# EAGLE design SuperScreen (EAGLE 9.1.2)
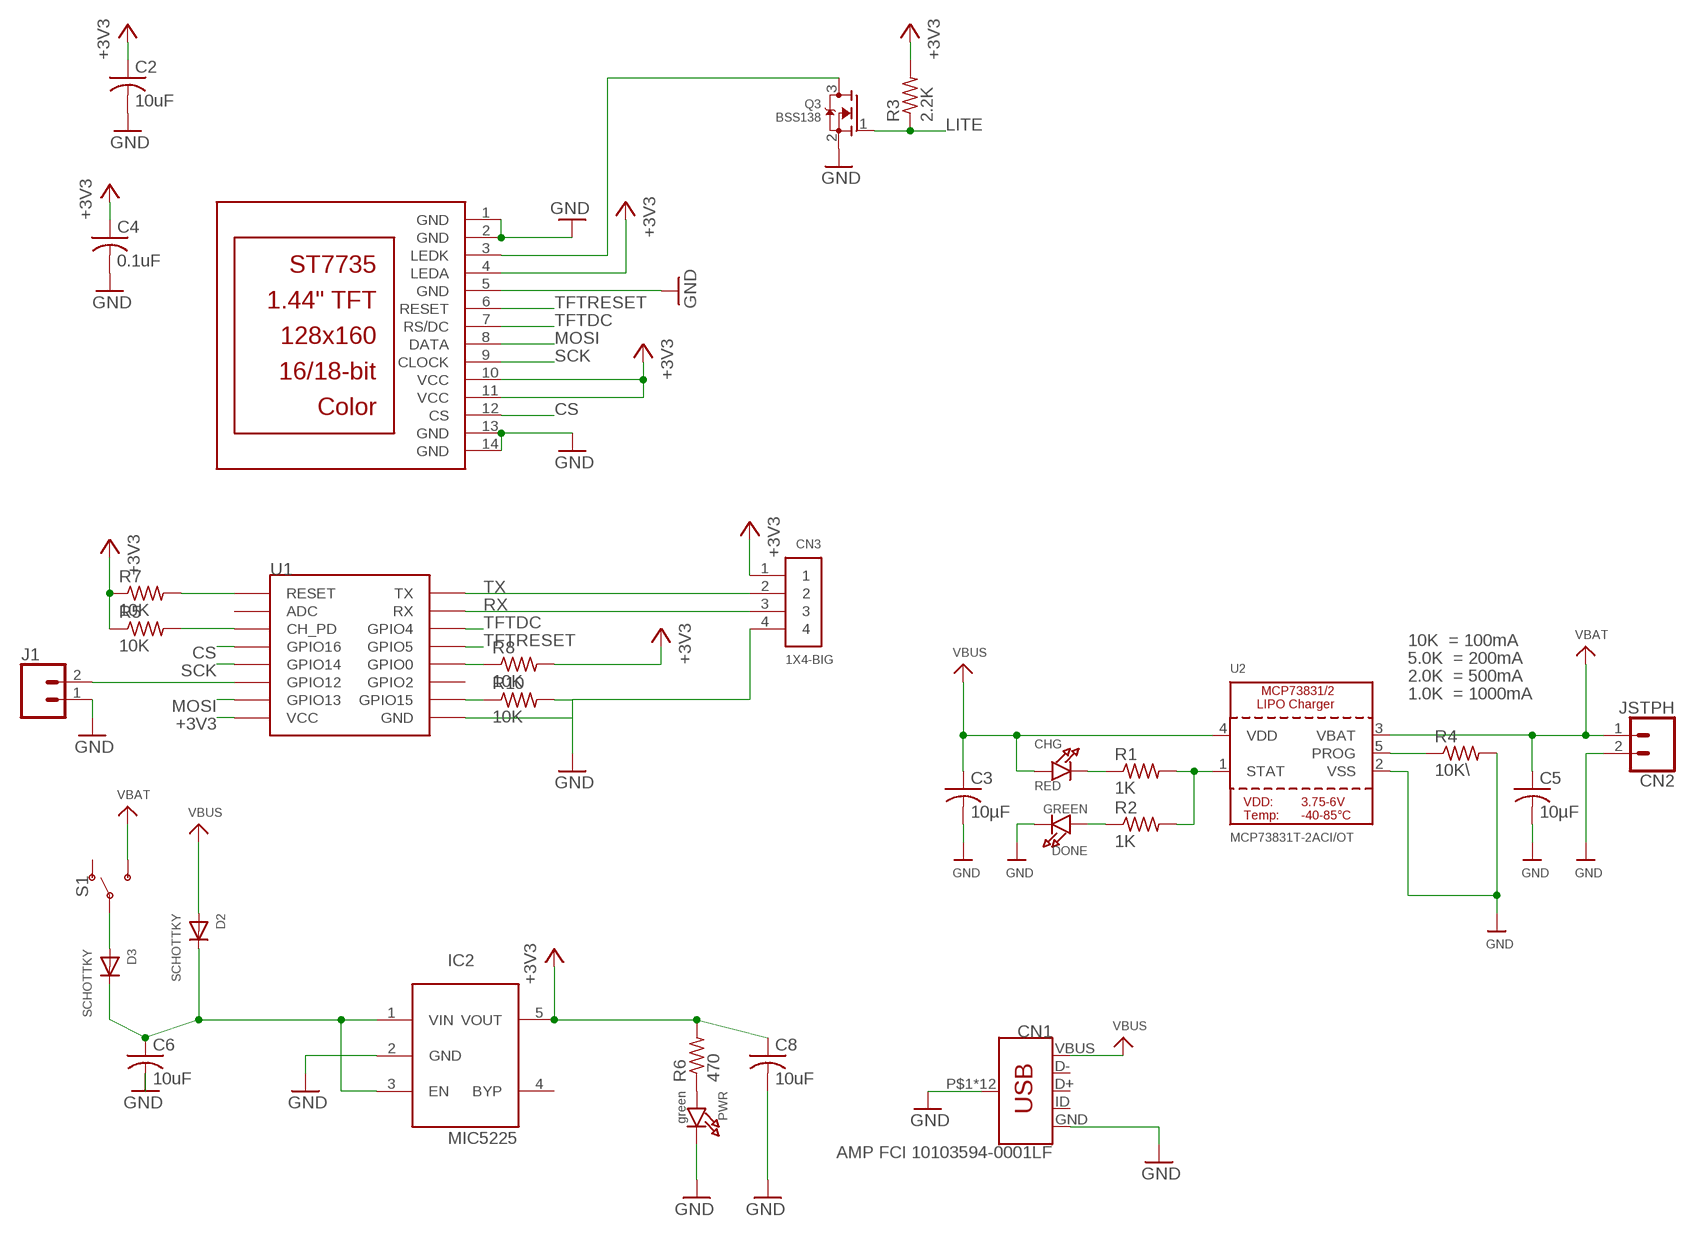
[diagram p0: schematic, sheet 1]

## Parts
C2  10uF  C-USC0805  [C0805]
C3  10µF  C-USC0805  [C0805]
C4  0.1uF  C-USC0805  [C0805]
C5  10µF  C-USC0805  [C0805]
C6  10uF  C-USC0805  [C0805]
C8  10uF  C-USC0805  [C0805]
CHG  RED  LED0805_NOOUTLINE  [CHIPLED_0805_NOOUTLINE]
CN1  AMP FCI 10103594-0001LF  USB_MICRO-B_HALF_PTH  [USB-MICROB-PTH]
CN2  JSTPH  CONN_02  [1X02]
CN3  1X4-BIG  [1X04-BIG]
D2  SCHOTTKY  DIODE_SOD-123FL  [SOD-123FL]
D3  SCHOTTKY  DIODE_SOD-123FL  [SOD-123FL]
DONE  GREEN  LED0805_NOOUTLINE  [CHIPLED_0805_NOOUTLINE]
IC2  MIC5225  LP298XS  [SOT23-5L]
J1  CONN_02  [1X02]
PWR  green  LED0805_NOOUTLINE  [CHIPLED_0805_NOOUTLINE]
Q3  BSS138  MOSFET-NWIDE  [SOT23-WIDE]
R1  1K  R-US_R0805  [R0805]
R2  1K  R-US_R0805  [R0805]
R3  2.2K  R-US_R0805  [R0805]
R4  10K\  R-US_R0805  [R0805]
R5  10K  R-US_R0805  [R0805]
R6  470  R-US_R0805  [R0805]
R7  10K  R-US_R0805  [R0805]
R8  10K  R-US_R0805  [R0805]
R10  10K  R-US_R0805  [R0805]
S1  SWITCH-SPDT-SMD-RIGHT-ANGLE  [SWITCH_SPST_SMD_A]
TFT2  DISP_LCD_ST7735_1.44IN  [TFT_1.44IN_128_128]
U1  ESP12SMD  [ESP12-SMD]
U2  MCP73831T-2ACI/OT  MCP73831/2  [SOT23-5]

## Nets
+3V3 [power]: C2.1 C4.1 C8.1 CN3.1 IC2.5(VOUT) R3.2 R5.1 R6.2 R7.1 R8.2 TFT2.4(LEDA) TFT2.10(VCC) TFT2.11(VCC) U1.VCC
CS: TFT2.12(CS) U1.GPIO16
GND [power]: C2.2 C3.2 C4.2 C5.2 C6.2 C8.2 CN1.GND CN1.P$1(SHIELD) CN1.P$2(SHIELD) CN1.P$3(SHIELD) CN1.P$4(SHIELD) CN1.P$6(SHIELD) CN1.P$8(SHIELD) CN1.P$10(SHIELD) CN1.P$12(SHIELD) CN1.SHEILD2(SHIELD) CN1.SHIELD CN1.SHIELD3(SHIELD) CN1.SHIELD4(SHIELD) CN2.2 CN3.4 DONE.C IC2.2(GND) J1.1 PWR.C Q3.2(S) R4.2 R10.2 TFT2.1(GND) TFT2.2(GND) TFT2.5(GND) TFT2.13(GND) TFT2.14(GND) U1.GND U2.2(VSS)
LED- [power]: Q3.3(D) TFT2.3(LEDK)
LITE: Q3.1(G) R3.1
MOSI: TFT2.8(DATA) U1.GPIO13
N$1: CHG.C R1.1
N$2: R7.2 U1.RESET
N$3 [power]: D3.A S1.2(P)
N$4: R1.2 R2.2 U2.1(STAT)
N$6: J1.2 U1.GPIO12
N$8: R4.1 U2.5(PROG)
N$9: PWR.A R6.1
N$10: DONE.A R2.1
N$11: R8.1 U1.GPIO0
N$13 [power]: C6.1 D2.C D3.C IC2.1(VIN) IC2.3(EN)
N$15: R5.2 U1.CH_PD
N$16: R10.1 U1.GPIO15
RX: CN3.3 U1.RXD0(RX)
SCK: TFT2.9(CLOCK) U1.GPIO14
TFTDC: TFT2.7(RS/DC) U1.GPIO4
TFTRESET: TFT2.6(RESET) U1.GPIO5
TX: CN3.2 U1.TXD0(TX)
VBAT [power]: C5.1 CN2.1 S1.3(S) U2.3(VBAT)
VBUS [power]: C3.1 CHG.A CN1.VBUS D2.A U2.4(VDD)
Unconnected: CN1.D+ CN1.D- CN1.ID IC2.4(BYP) S1.1(O) U1.ADC U1.GPIO2

## Notes on the sheet
- 10K  = 100mA
- 5.0K  = 200mA
- 2.0K  = 500mA
- 1.0K  = 1000mA

## Library data of the parts
C2-C6 C8 = adafruit:C-US: CAPACITOR, American symbol
CHG DONE PWR = microbuilder:LED: LED 0603 - 0603 Surface Mount Package 2mA: Green LED - Low Power (3.9mcd, 2ma, 1.7Vf) - Digikey: 475-2709-2-ND Orange LED - Low Power (9.8mcd, 2ma, 1.8Vf) - Digikey: 475-1194-2-ND Red LED - Low Power (5mcd, 2ma, 1.8Vf) - Digikey: 475-1195-2-ND Yellow LED - Low Power (7mcd, 2ma, 1.8Vf) - Digikey: 475-1196-2-ND 5mA: Blue LED - Low Power (17mcd, 5ma, 2.9Vf) - Digikey: LNJ937W8CRACT-ND 0805 - 0805 Surface Mount Package 2mA: Red LED (8.8mcd, 2mA, 1.8Vf, Clear) - Low Power [Digikey: 475-2510-1-ND] Green LED (5mcd, 2mA, 1.8Vf, Clear) - Low Power [Digikey: 475-2730-1-ND] Yellow LED (11.3mcd, 2mA, 1.8Vf, Clear) - Low Power [Digikey: 475-2555-1-ND] 20mA: Red LED (104mcd, 20mA, Diffused) - LS R976 [Digikey: 475-1278-6-ND] Red LED (12mcd, 20mA, 2.0Vf, Clear) - APT2012EC [Digikey: 754-1128-1-ND] Green LED (15mcd, 20mA, 2.2Vf, Clear) - APT2012GC [Digikey: 754-1131-1-ND] Orange LED (160mcd, 20mA, 2.1Vf, Clear) - APT2012SECK [Digikey: 754-1130-1-ND] 1206 - 1206 Surface Mount Package Green LED (26mcd, 20mA, Diffused) - LG N971 [Digikey: 475-1407-6-ND] Red LED (15mcd, 20mA, Diffused) - LH N974 [Digikey: 475-1416-6-ND] Cree - Cree High-Power Surface Mount LEDs XPEBWT-L1-0000-00D50 - White 111lm 350mA 2.9Vf 6200K 110° XTEAWT-00-0000-00000LEE3 - White 114lm 350mA 2.85Vf 5000K 115° Everlight - Everlight 45-21 Series Surface Mount LEDs 45-21/QK2C-B2832AC2CB2/2T - Warm White 2000mcd 20mA 3.25Vf 3050K 120° 45-21/LK2C-B38452C4CB2/2T - Nuetral White 2000mcd 20mA 3.25Vf 4150K 120° 45-21/LK2C-B50634C6CB2/2T - Cold White 2200mcd 20mA 3.25Vf 5650K 120° PLCC2 Reverse Mount LS T77K-J1L2-1-0-2-R18-Z - Red 11.25mcd 2mA 1.8Vf 630nm 120° LO T77K-L1M2-24-Z - Orange 19.6mcd 2mA 1.8Vf 606nm 120° LY T77K-K2M1-26-Z - Yellow 15.7mcd 2mA 1.8Vf 587nm 120°
CN1 = SparkFun-Connectors:USB_MICRO-B: USB Type Micro-B Connector Male/female and PTH/SMT variants SparkFun Products: SparkFun microB USB Breakout <https://www.sparkfun.com/products/12035> SparkFun USB microB Plug Breakout <https://www.sparkfun.com/products/10031> SparkFun ESP8266 Thing <https://www.sparkfun.com/products/13231>; PROD_ID: CONN-13711
CN2 J1 = SparkFun-Connectors:CONN_02: Multi connection point. Often used as Generic Header-pin footprint for 0.1 inch spaced/style header connections On any of the 0.1 inch spaced packages, you can populate with these: Break Away Headers - Straight <https://www.sparkfun.com/products/116> (PRT-00116) Break Away Male Headers - Right Angle <https://www.sparkfun.com/products/553> (PRT-00553) Female Headers <https://www.sparkfun.com/products/115> (PRT-00115) Break Away Headers - Machine Pin <https://www.sparkfun.com/products/117> (PRT-00117) Break Away Female Headers - Swiss Machine Pin <https://www.sparkfun.com/products/743> (PRT-00743) For SCREWTERMINALS and SPRING TERMINALS visit here: Screw Terimnals on SparkFun.com <https://www.sparkfun.com/search/results?term=Screw+Terminals> (5mm/3.5mm/2.54mm spacing) This device is also useful as a general connection point to wire up your design to another part of your project. Our various solder wires solder well into these plated through hole pads. Hook-Up Wire - Assortment (Stranded, 22 AWG) <https://www.sparkfun.com/products/11375> (PRT-11375) Hook-Up Wire - Assortment (Solid Core, 22 AWG) <https://www.sparkfun.com/products/11367> (PRT-11367) View the entire wire category on our website here <https://www.sparkfun.com/categories/141> Special notes: Molex polarized connector foot print use with: PRT-08233 with associated crimp pins and housings. 2.54_SCREWTERM for use with PRT-10571. 3.5mm Screw Terminal footprints for PRT-08084 5mm Screw Terminal footprints for use with PRT-08432
CN3 = adafruit:1X4: 4-pin connector
D2 D3 = adafruit:DIODE: Diode SMADIODE - SMA Surface Mount Package 20V 1A Schottky Diode Digikey: 641-1014-6-ND DO-1N4148 - Through Hole Small Current Diode SOD-123 20V 1 A (.5mV Vf) Schottky Diode - Digikey: MBRX120TPMSCT-ND SOD-323 10V 570mA (.38mV Vf, 3ns) Schottky Diode - Digikey: ZLLS410CT-ND SOD-523 30V 30mA Schottky Diode (RB751S-40TE61) - Digikey: RB751S-40TE61CT-ND SOT23-R/W - SOT23 Package (R = Solder Paste/Reflow Ovens, W = Hand-Soldering) BAT54Film 40V 300mA - Digikey: 497-7162-1-ND
IC2 = adafruit:LP298X
Q3 = microbuilder:MOSFET-N: N-Channel Mosfet LEGEND VDS: Voltage Drain-Source ID: Drain Current RDS(ON): Drain-Source On-State Resistance VGS(TH): Gate-Source Threshold Voltage CISS: Drain-Source Input Capacitance SOT-23 Name VDS ID RDS(ON) VGS(TH) CISS Order Number 2N7002E 60V 260mA 2.5 Ohm 2.5V @ 250uA 26.7pF @ 25V 2N7002ET1GOSTR-ND BSH103 30V 850mA 400 mOhm 400mV @ 1mA 83pF @ 24V BSH103,235-ND BSS138 60V 320mA 1.6 Ohm 1.5V @ 250uA 50pF @ 10V Mouser: 771-BSS138PW115 DMN2075U-7 20V 4.2A 38 mOhm 1V @ 250 uA 594.3pF @ 10V DMN2075U-7DICT-ND * BSS138 good choice for I2C level-shifting POWERPAK 1212-8 Name VDS ID RDS(ON) VGS(TH) CISS Order Number Si7308DN 60V 6A 58 mOhm 3V @ 250uA 665pF @ 15V SI7308DN-T1-E3CT-ND
R1-R8 R10 = adafruit:R-US_: RESISTOR, American symbol
S1 = SparkFun-Switches:SWITCH-SPDT: Single Pole, Double Throw (SPDT) Switch Single-pole, double-throw (SPDT) switch. Variant Overview SMD-AYZ0202 Surface Mount DPDT Switch <https://www.sparkfun.com/products/597> (COM-00597) Used on e.g. LilyPad Arduino USB - ATmega32U4 Board <https://www.sparkfun.com/products/12049> PTH-11.6X4.0MM SPDT Mini Power Switch <https://www.sparkfun.com/products/102> (COM-00102) Used on e.g. SparkFun Simon Says - Through-Hole Soldering Kit <https://www.sparkfun.com/products/10547> (KIT-10547) PTH-11.6X4.0MM-KIT KIT version of SPDT Mini Power Switch - Simplifies soldering by removing tStop of switch pins - only one side can be soldered. PTH-11.6X4.0MM-LOCK LOCK version of SPDT Mini Power Switch - Offset pins hold switch in place for easier soldering. SMD-RIGHT-ANGLE Surface Mount Right Angle Switch <https://www.sparkfun.com/products/10860> (COM-10860) Used on e.g. SparkFun ESP8266 Thing <https://www.sparkfun.com/products/13231>; PROD_ID: SWCH-10651; SF_SKU: COM-10860
TFT2 = microbuilder:DISP_LCD_ST7735_1.44IN
U1 = esp8266modules:ESP12: ESP8266 Wifi module 12
U2 = microbuilder:MCP73831/2: MCP73831/2 LIPO Charger VDD: 3.75 - 6V Temp -40 - 85°C Programmable Charge Rate: 15-500mA NOTE: STAT is a tri-state logic output on the MCP73831 and an open-drain output on the MCP73832. SOT23-5 with 4.2V output and tri-state logic on STAT = MCP73831T-2ACI/OT

## Net classes
1 power: width 0.406 mm

## Board
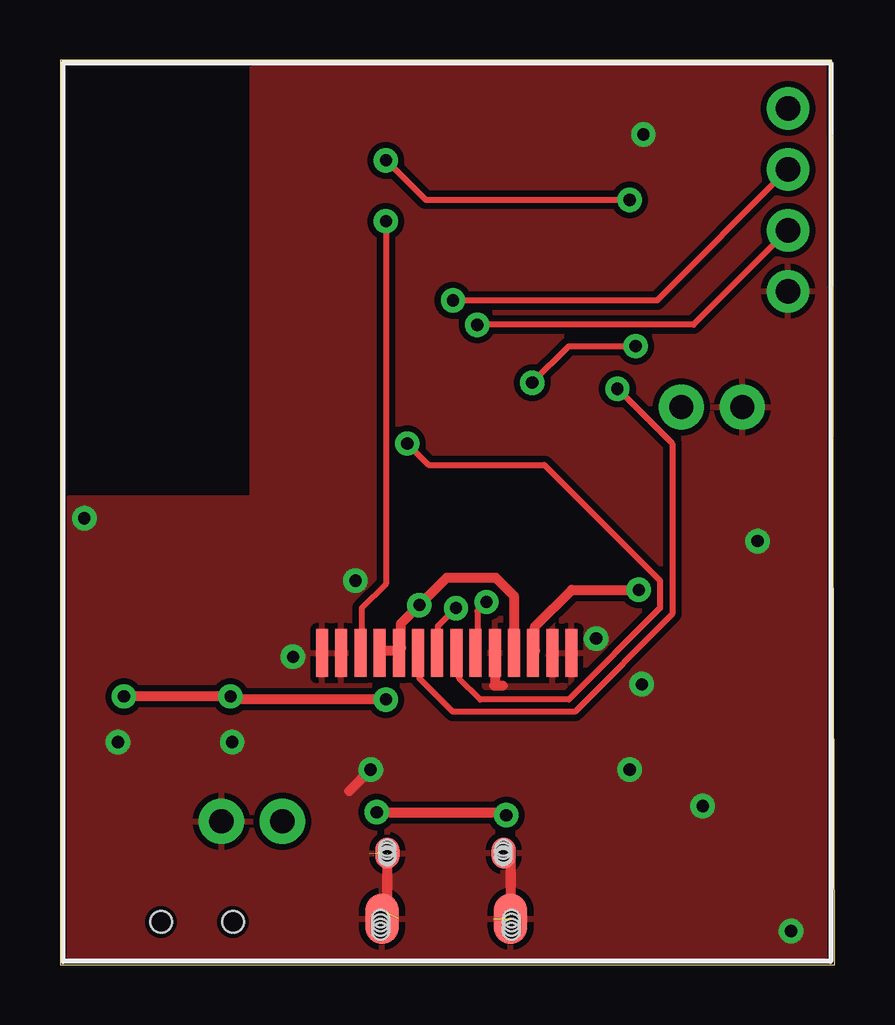
[diagram p1: board, top side]
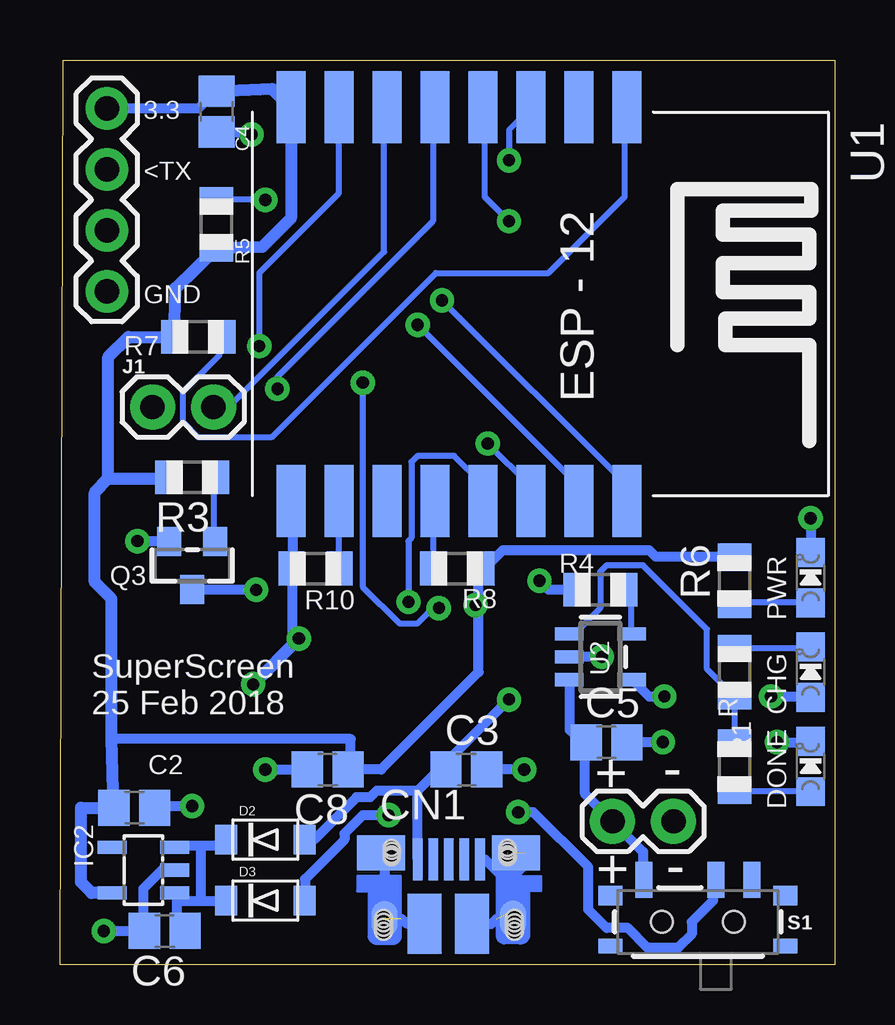
[diagram p2: board, bottom side, seen from below]

Size 32.31 x 37.71 mm. Coordinates in mm from the lower left corner, seen from the top.
Outline: 0,0 32.31,0 32.18,37.71 0,37.71 0,0
Copper layers (1*16): Top 0.035mm / dielectric 1.5mm / Bottom 0.035mm
Design rules "SparkFun-2-layer-STANDARD": minimum track width 10mil, minimum drill 20mil, track to track 10mil, track to pad 8mil, pad to pad 8mil, via to via 10mil, smd to smd 8mil, copper to edge 8mil, drill to drill 8mil, minimum pad ring 10mil, minimum via ring 10mil, stop-mask expansion 4mil, vias tented up to drill 25mil, thermal gap 10mil

### Footprints (pad centres in the part's own frame; a part is rotated, then mirrored left to right if it is on the bottom)
C0805 = smd 1.3 x 1.5: 1 -0.85,0; 2 0.85,0
CHIPLED_0805_NOOUTLINE = smd 1.2 x 1.2: A 0,-1.05; C 0,1.05
USB-MICROB-PTH = smd 0.4 x 1.75: D+ 0.031,1.331; D- -0.619,1.331; GND 1.331,1.331; ID 0.681,1.331; VBUS -1.269,1.331 | smd 1.4 x 2.1 bottom: P$1 2.701,-1.142; P$3 -2.659,-1.144 | smd 1 x 1.3: P$2 2.487,1.594; P$6 -2.368,1.604 | smd 1 x 1.3 bottom: P$4 -2.368,1.604; P$10 2.481,1.598 | smd 1.1 x 1.5: P$8 2.701,-1.142; P$12 -2.659,-1.144 | smd 2 x 1.46: SHEILD2 2.831,1.606; SHIELD -2.794,1.606 | smd 1.425 x 2.5: SHIELD3 -0.979,-1.349; SHIELD4 0.996,-1.352 | hole 0.7: -2.693,-1.134; -2.693,-1.3; -2.694,-1.499; -2.694,-1.664; 2.768,-1.134; 2.767,-1.303; 2.766,-1.496; 2.766,-1.664 | hole 0.66: -2.359,1.821; -2.349,1.691; -2.359,1.541; -2.354,1.432; 2.481,1.821; 2.491,1.691; 2.481,1.541; 2.486,1.432
1X02 = drill 1.016 pad 1.88: 1 0,0; 2 2.54,0
1X04-BIG = drill 1.016 pad 1.778: 1 0,0; 2 2.54,0; 3 5.08,0; 4 7.62,0
SOD-123FL = smd 0.91 x 1.22: A 1.637,0; C -1.637,0
SOT23-5L = smd 0.55 x 1.2: 1 -0.95,-1.3; 2 0,-1.3; 3 0.95,-1.3; 4 0.95,1.3; 5 -0.95,1.3
SOT23-WIDE = smd 1 x 1.2: 1 -0.95,-1; 2 0.95,-1; 3 0,1
R0805 = smd 1.1 x 1.4: 1 -1,0; 2 1,0
SWITCH_SPST_SMD_A = smd 0.7 x 1.5: 1 -2.25,-1.75; 2 -0.75,-1.75; 3 2.25,-1.75 | smd 1 x 0.6: GND1 -3.65,1; GND3 3.65,1 | smd 1 x 0.8: GND2 -3.65,-1.1; GND4 3.65,-1.1 | hole 0.9: -1.5,0; 1.5,0
TFT_1.44IN_128_128 = smd 0.5 x 2: 1 5.2,12.855; 2 4.4,12.855; 3 3.6,12.855; 4 2.8,12.855; 5 2,12.855; 6 1.2,12.855; 7 0.4,12.855; 8 -0.4,12.855; 9 -1.2,12.855; 10 -2,12.855; 11 -2.8,12.855; 12 -3.6,12.855; 13 -4.4,12.855; 14 -5.2,12.855
ESP12-SMD = smd 3 x 1.2: ADC -8.3,3.8; CH_PD -8.3,1.8; GND 8.1,-8.2; GPIO0 8.1,-2.2; GPIO2 8.1,-4.2; GPIO4 8.1,1.8; GPIO5 8.1,-0.2; GPIO12 -8.3,-4.2; GPIO13 -8.3,-6.2; GPIO14 -8.3,-2.2; GPIO15 8.1,-6.2; GPIO16 -8.3,-0.2; RESET -8.3,5.8; RXD0 8.1,3.8; TXD0 8.1,5.8; VCC -8.3,-8.2
SOT23-5 = smd 0.55 x 1.2: 1 -0.95,-1.3; 2 0,-1.3; 3 0.95,-1.3; 4 0.95,1.3; 5 -0.95,1.3

### Placement (x,y rotation side)
C2  29.21,6.54 0 bottom
C3  15.37,8.13 0 bottom
C4  25.78,35.56 270 bottom
C5  9.52,9.27 0 bottom
C6  27.94,1.4 180 bottom
C8  21.15,8.13 180 bottom
CHG  1.02,12.19 0 bottom
CN1  16.13,3.05 0 bottom
CN2  9.27,5.97 0 bottom
CN3  30.35,35.69 270 bottom
D2  23.75,5.21 0 bottom
D3  23.75,2.67 0 bottom
DONE  1.02,8.26 0 bottom
IC2  28.83,3.94 90 bottom
J1  28.45,23.24 0 bottom
PWR  1.02,16.13 0 bottom
Q3  26.8,16.64 180 bottom
R1  4.19,12.19 270 bottom
R2  4.19,8.26 90 bottom
R3  26.8,20.32 180 bottom
R4  9.78,15.62 180 bottom
R5  25.78,30.86 90 bottom
R6  4.19,16 90 bottom
R7  26.54,26.16 0 bottom
R8  15.75,16.51 0 bottom
R10  21.65,16.51 180 bottom
S1  5.72,1.78 180 bottom
TFT2  16.13,0.13 0 top
U1  14.48,27.43 270 bottom
U2  9.78,12.83 270 bottom

### Tracks (layer width: path | path; a pad name or v marks a point on that pad's centre or on a via)
+3V3  (via drill 0.51)
  Top 0.406: TFT2.11 13.34,13.08 14.1,13.08 TFT2.10 14.22,13.21 14.22,14.22 v14.99,14.99 16.13,16.13 18.16,16.13 18.92,15.37 18.92,13.08 TFT2.4
  Bottom 0.406: CN3.1 26.54,35.69 25.91,36.32 C4.1 | 14.86,14.99 14.86,12.19 18.92,8.13 C8.1 20.19,8.38 20.19,9.4 30.16,9.4 | 14.86,14.99 14.86,16.51 R8.2 14.6,16.51 13.84,17.27 7.75,17.27 7.49,17.02 4.19,17.02 R6.2 | v14.99,14.99 14.86,14.99
  Bottom 0.508: IC2.5 30.99,2.99 31.43,3.43 31.43,6.54 C2.1 30.16,9.4 30.16,15.24 30.86,15.94 30.86,19.68 30.29,20.26 | 30.29,20.26 27.81,20.26 R3.2 | 30.29,20.26 30.29,25.34 29.46,26.16 R7.1 27.49,28.2 R5.1 23.88,29.91 22.68,31.11 U1.VCC 23.46,36.51 C4.1
CS  (via drill 0.51)
  Top 0.254: v13.59,30.99 13.59,15.88 12.57,14.86 12.57,13.08 TFT2.12
  Bottom 0.254: v13.59,30.99 14.6,32 14.6,35.69 U1.GPIO16
GND  (via drill 0.51)  (7 unrouted)
  Top 0.406: v12.95,8.13 12.06,7.24 | CN1.P$1 13.65,2.13 CN1.P$10 | CN1.P$6 18.79,4.36 CN1.P$3 | TFT2.5 18.13,11.66 18.1,11.63 18.45,11.63
  Bottom 0.406: 22.61,16.51 22.61,19.3 U1.GND | 22.61,16.51 R10.2 | IC2.2 28.07,3.94 28.83,3.18 28.83,1.4 C6.2 v30.48,1.4 | v2.41,9.27 1.02,9.27 DONE.C | v1.02,18.61 PWR.C | v9.72,12.83 U2.2 | v29.08,17.65 27.81,17.65 Q3.2 | v7.17,9.27 C5.2 | v12.95,8.13 C3.2 | v23.75,8.13 C8.2 | v26.8,6.6 28.19,6.6 C2.2 | C4.2 25.78,34.67 24.38,34.67 v24.32,34.61 | v22.35,13.59 22.61,13.84 22.61,16.51 | R4.2 11.94,15.62 v12.32,16 | CN1.GND 14.58,4.38 13.95,3.74 13.34,3.74 12.9,4.18 12.9,4.64 | CN1.SHIELD3 17.86,1.7 18.06,1.9 | CN1.SHIELD4 14.33,1.7 14.12,1.91 | CN1.SHIELD 18.79,4.52 CN1.P$3 | CN1.SHEILD2 13.43,4.52 CN1.P$1
  Bottom 0.508: v22.35,13.59 v24.26,11.68
  pour Top: 0.38,0.38 31.88,0.38 31.88,37.34 8,37.34 8,19.43 0.38,19.43
LED-  (via drill 0.51)
  Top 0.406: v24.13,15.62 21.34,15.62 19.81,14.1 19.81,13.08 TFT2.3
  Bottom 0.406: v24.13,15.62 26.8,15.62 Q3.3
LITE
  Bottom 0.254: Q3.1 25.91,17.65 25.91,20.32 R3.1
MOSI  (via drill 0.51)
  Top 0.254: v16.51,14.86 15.75,14.1 15.75,13.08 TFT2.8 | v19.69,24.26 21.21,25.78 v24,25.78
  Bottom 0.254: v16.51,14.86 16.76,14.86 17.4,14.22 18.16,14.22 19.69,15.75 v19.69,24.26 | v24,25.78 24,28.83 20.7,32.13 20.7,35.69 U1.GPIO13
N$1
  Bottom 0.254: CHG.C 1.02,13.21 4.19,13.21 R1.1
N$2
  Bottom 0.254: R7.2 25.65,26.16 25.65,25.4 27.18,23.88 27.18,22.61 26.54,21.97 23.49,21.97 16.64,28.83 11.94,28.83 8.76,32 8.76,35.69 U1.RESET
N$3  (via drill 0.51)
  Top 0.406: v13.21,6.35 18.48,6.35 v18.6,6.22
  Bottom 0.406: D3.A 22.1,3.56 20.45,5.21 20.45,5.46 19.69,6.22 v18.6,6.22 | S1.2 5.08,3.43 5.08,2.67 5.97,1.78 5.97,1.27 6.54,0.7 7.81,0.7 8.64,1.52 9.52,1.52 10.29,2.29 10.29,4.06 12.57,6.35 v13.21,6.35
N$4
  Bottom 0.254: R1.2 5.33,12.32 5.33,13.97 8,16.64 9.52,16.64 9.78,16.38 9.78,14.86 10.8,13.84 11.05,13.84 U2.1 | R1.2 R2.2 | R1.2
N$6
  Bottom 0.254: J1.2 25.27,23.24 18.8,29.72 18.8,35.69 U1.GPIO12
N$8
  Bottom 0.254: R4.1 8.51,15.37 8.51,13.84 U2.5
N$9
  Bottom 0.254: PWR.A 1.02,15.11 4.19,15.11 R6.1
N$10
  Bottom 0.254: DONE.A 1.02,7.24 4.19,7.24 R2.1
N$11
  Bottom 0.254: R8.1 16.76,16.51 16.76,19.3 U1.GPIO0
N$13
  Bottom 0.406: 26.42,4.95 25.65,4.95 D2.C | 26.42,4.95 27.43,4.95 IC2.3 | 27.43,2.67 27.43,1.78 27.05,1.4 C6.1 | 27.43,2.67 27.43,2.92 IC2.1 | 27.43,2.67 26.42,2.67 | 26.42,2.67 D3.C | 26.42,2.67 26.42,4.95
N$15  (via drill 0.51)
  Top 0.254: v23.75,31.88 15.24,31.88 v13.59,33.53
  Bottom 0.254: v23.75,31.88 25.78,31.88 R5.2 | v13.59,33.53 13.59,34.8 12.7,35.69 U1.CH_PD
N$16
  Bottom 0.254: R10.1 20.7,16.51 20.7,19.3 U1.GPIO15
RX  (via drill 0.51)
  Top 0.254: v17.4,26.67 26.42,26.67 CN3.3
  Bottom 0.254: v17.4,26.67 10.8,20.07 10.8,19.43 U1.RXD0
SCK  (via drill 0.51)
  Top 0.254: v23.24,24 25.53,21.72 25.53,14.61 21.46,10.54 16.38,10.54 14.99,11.94 14.99,12.95 TFT2.9
  Bottom 0.254: v23.24,24 23.24,24.51 16.76,30.99 16.76,35.69 U1.GPIO14
TFTDC  (via drill 0.51)
  Top 0.254: v14.48,21.72 15.37,20.83 20.19,20.83 25.02,16 25.02,14.86 21.21,11.05 17.53,11.05 16.64,11.94 16.64,12.95 TFT2.7
  Bottom 0.254: v14.48,21.72 12.7,19.94 12.7,19.43 U1.GPIO4
TFTRESET  (via drill 0.51)
  Top 0.254: v17.78,15.11 17.4,14.73 17.4,13.08 TFT2.6
  Bottom 0.254: v17.78,15.11 17.78,17.65 17.65,17.78 17.65,20.96 17.4,21.21 15.88,21.21 14.73,20.07 14.73,19.43 U1.GPIO5
TX  (via drill 0.51)
  Top 0.254: v16.38,27.69 24.89,27.69 CN3.2
  Bottom 0.254: v16.38,27.69 8.76,20.07 8.76,19.43 U1.TXD0
VBAT
  Bottom 0.406: U2.3 11.05,11.81 11.05,9.78 10.54,9.27 C5.1 10.41,9.14 10.41,7.11 CN2.1 8,4.7 8,3.56 S1.3
VBUS  (via drill 0.51)
  Top 0.406: v2.67,11.18 v7.11,11.18 7.24,11.05 v13.59,11.05
  Bottom 0.406: v2.67,11.18 1.02,11.18 CHG.A | v7.11,11.18 7.75,11.18 8.38,11.81 U2.4 | D2.A 21.72,5.21 19.95,6.97 19.38,6.97 19.11,7.24 17.4,7.24 | 16.38,8.13 C3.1 16.38,8.26 | 16.38,8.26 v13.59,11.05 | CN1.VBUS 17.4,7.24 | 17.4,7.24 16.38,8.26

### Text on the board
bNames: 3.3 | <TX | GND | SuperScreen / 25 Feb 2018 | - | + | - | +